# EAGLE design SPinner (EAGLE 9.4.2)
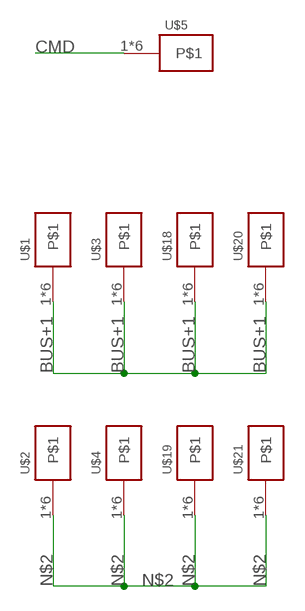
[diagram p0: schematic, sheet 1]

## Parts
U$1  KCONNECT  [KCONNECT]
U$2  KCONNECT  [KCONNECT]
U$3  KCONNECT  [KCONNECT]
U$4  KCONNECT  [KCONNECT]
U$5  KCONNECTQUAD  [KCONNECT_QUAD]
U$18  KCONNECT  [KCONNECT]
U$19  KCONNECT  [KCONNECT]
U$20  KCONNECT  [KCONNECT]
U$21  KCONNECT  [KCONNECT]

## Nets
BUS+1: U$1.1 U$1.2 U$1.3 U$1.4 U$1.P$1 U$1.P$2 U$3.1 U$3.2 U$3.3 U$3.4 U$3.P$1 U$3.P$2 U$18.1 U$18.2 U$18.3 U$18.4 U$18.P$1 U$18.P$2 U$20.1 U$20.2 U$20.3 U$20.4 U$20.P$1 U$20.P$2
CMD: U$5.1 U$5.2 U$5.3 U$5.4 U$5.P$1 U$5.P$2
N$2: U$2.1 U$2.2 U$2.3 U$2.4 U$2.P$1 U$2.P$2 U$4.1 U$4.2 U$4.3 U$4.4 U$4.P$1 U$4.P$2 U$19.1 U$19.2 U$19.3 U$19.4 U$19.P$1 U$19.P$2 U$21.1 U$21.2 U$21.3 U$21.4 U$21.P$1 U$21.P$2

## Library data of the parts
U$1-U$5 U$18-U$21 = CanCubeSat:KCONNECT

## Board
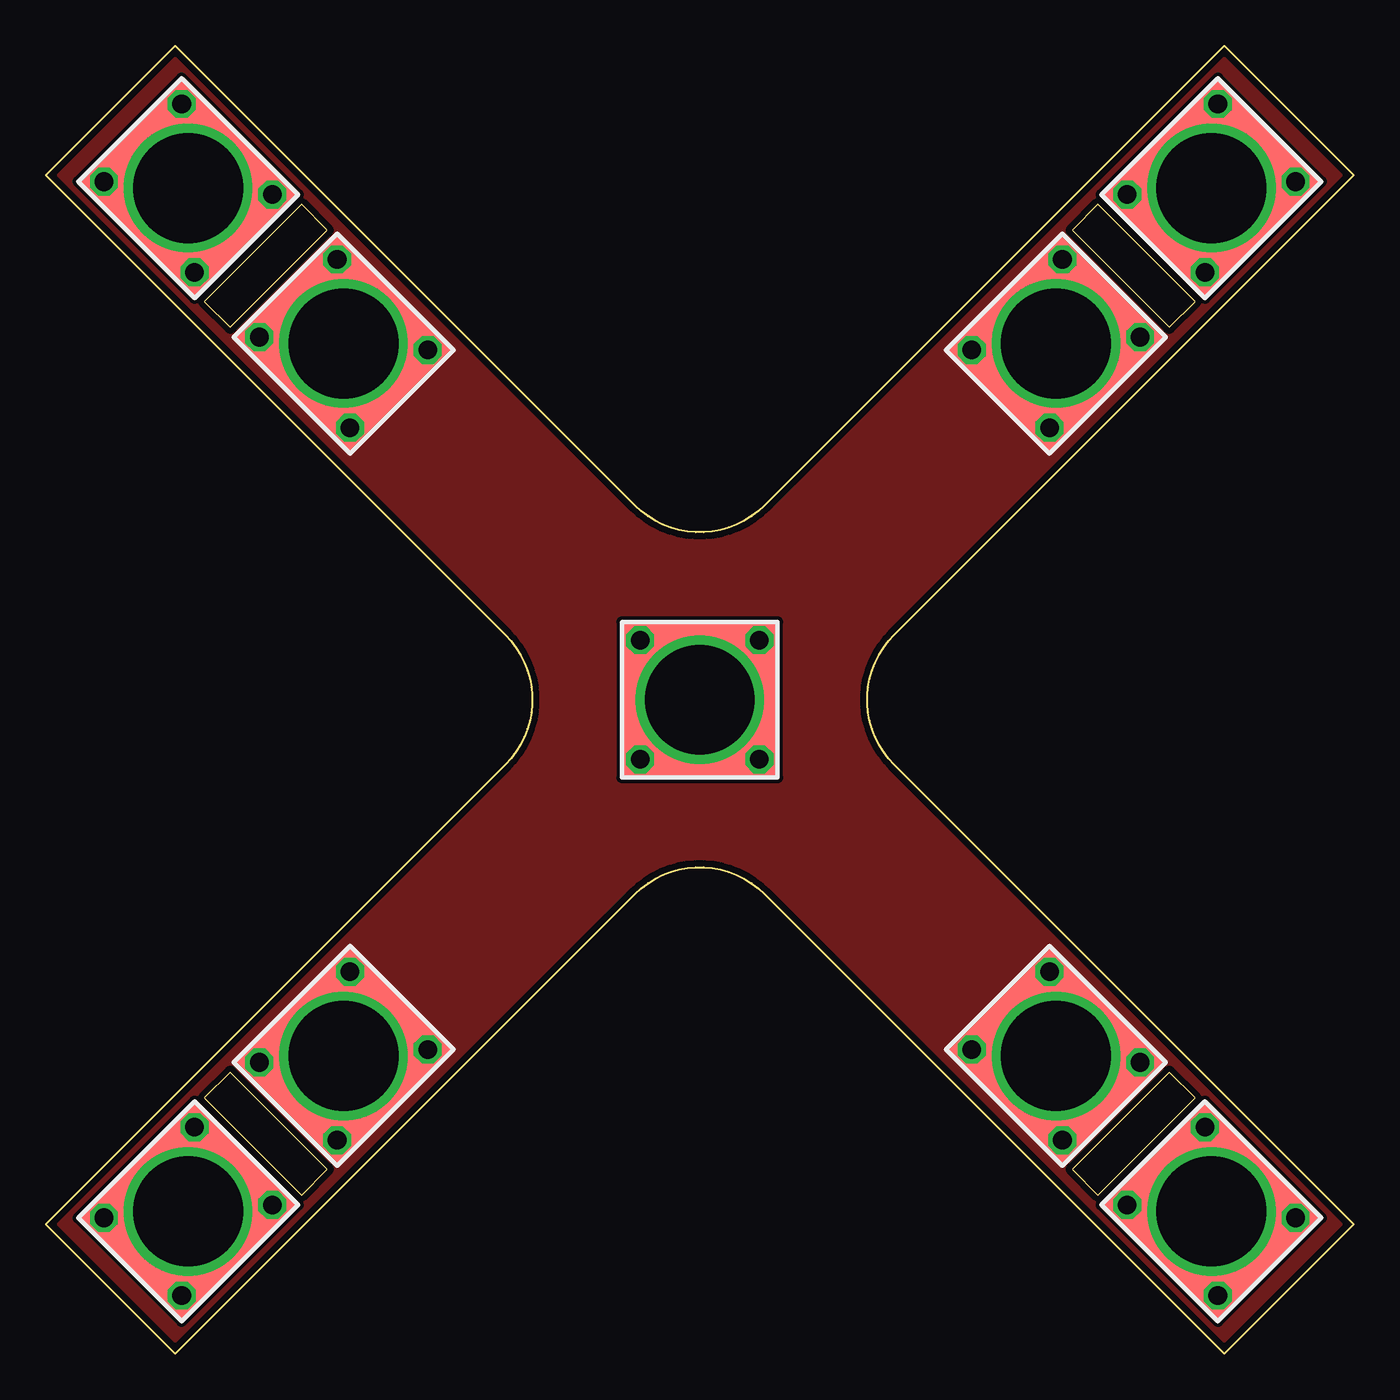
[diagram p1: board, top side]
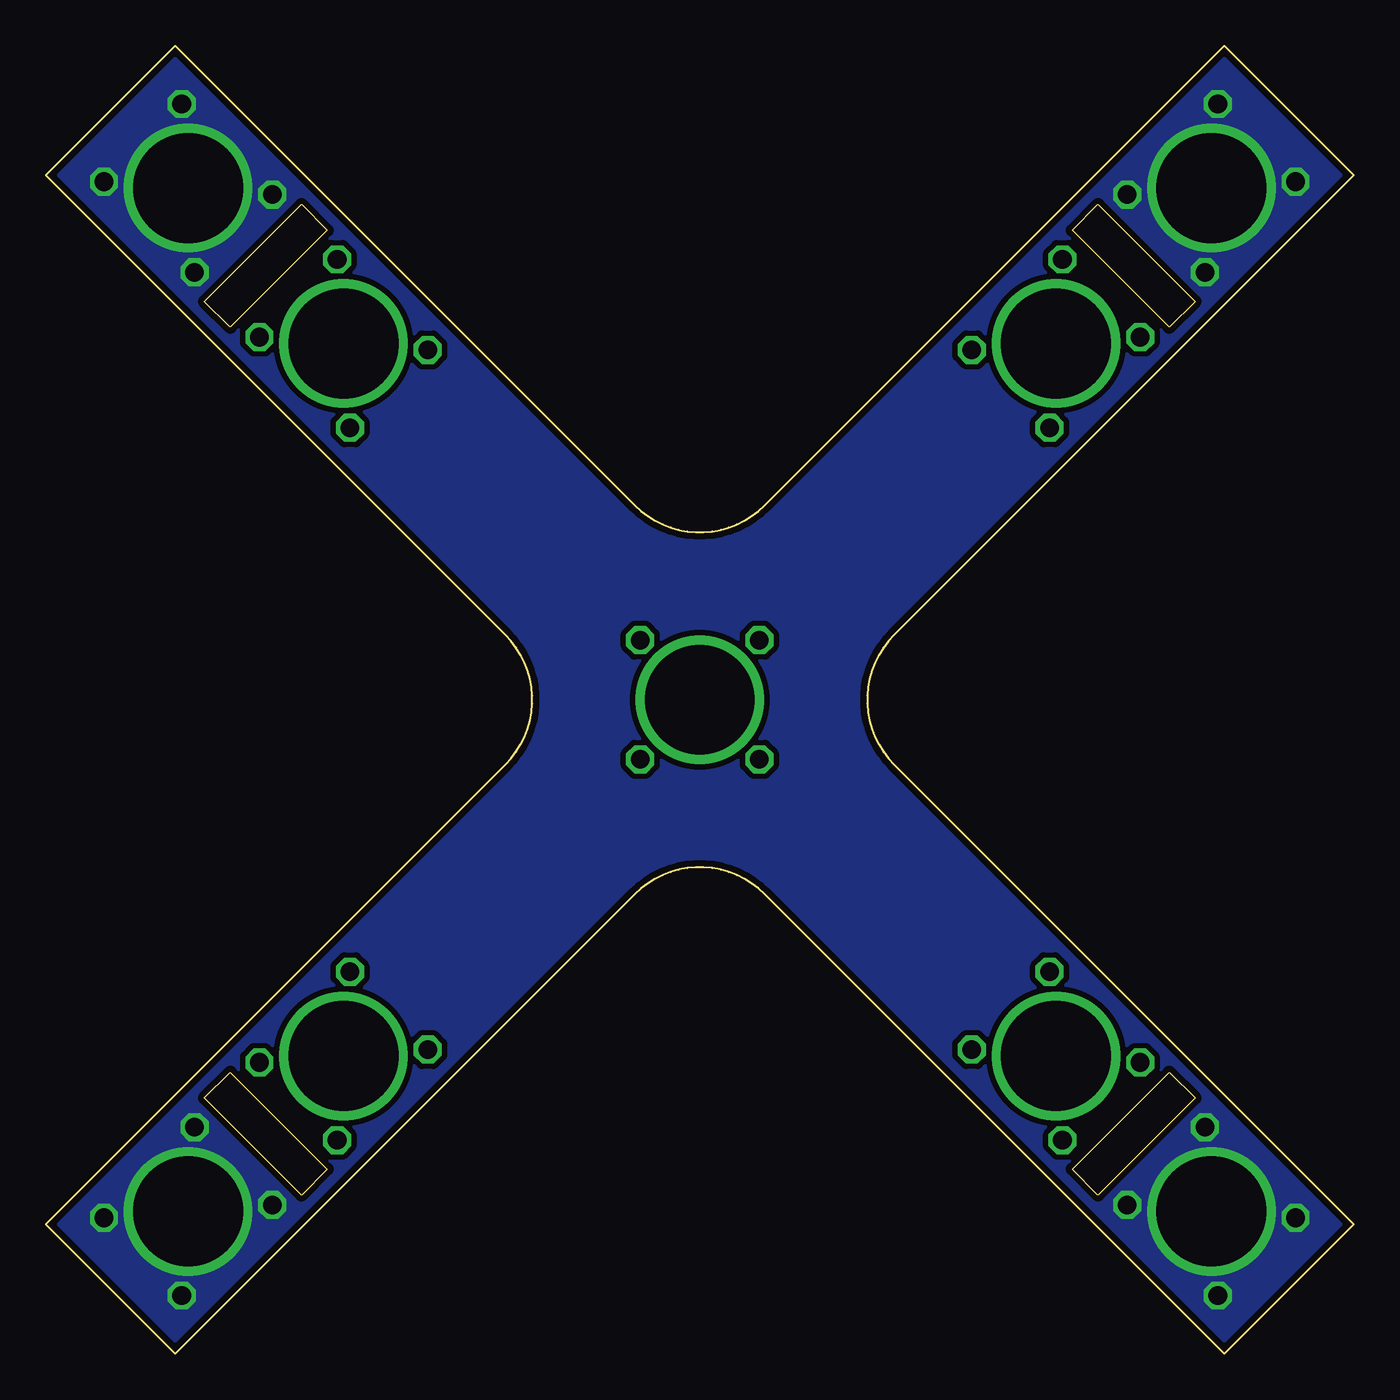
[diagram p2: board, bottom side, seen from below]

Size 71.4 x 71.4 mm. Coordinates in mm from the lower left corner, seen from the top.
Outline: 13.96,62.75 8.65,57.45 10.07,56.03 15.37,61.33 13.96,62.75
Outline: 8.65,13.96 13.96,8.65 15.37,10.07 10.07,15.37 8.65,13.96
Outline: 57.45,62.75 56.03,61.33 61.33,56.03 62.75,57.45 57.45,62.75
Outline: 56.03,10.07 57.45,8.65 62.75,13.96 61.33,15.37 56.03,10.07
Outline: 0,7.07 25.09,32.17 arc90 25.09,39.24 0,64.33 7.07,71.4 32.17,46.31 arc90 39.24,46.31 64.33,71.4 71.4,64.33 46.31,39.24 arc90 46.31,32.17 71.4,7.07 64.33,0 39.24,25.09 arc90 32.17,25.09 7.07,0 0,7.07
Copper layers (1*16): Top 0.035mm / dielectric 1.5mm / Bottom 0.035mm
Design rules "default *": minimum track width 0.8mm, minimum drill 0.35mm, track to track 0.2mm, track to pad 0.2mm, pad to pad 0.2mm, via to via 0.2mm, smd to smd 0.2mm, copper to edge 0.35mm, drill to drill 6mil, minimum pad ring 10mil, minimum via ring 8mil, stop-mask expansion 2mil, vias tented up to drill 0mil, thermal gap 10mil

### Footprints (pad centres in the part's own frame; a part is rotated, then mirrored left to right if it is on the bottom)
KCONNECT = drill 1.016 octagon: 1 -3,-3.5; 2 -3,3.5; 3 3,-3.5; 4 3,3.5 | drill 6: P$1 0,0 | smd 8 x 9: P$2 0,0
KCONNECT_QUAD = drill 1.016 octagon: 1 -3.25,-3.25; 2 -3.25,3.25; 3 3.25,-3.25; 4 3.25,3.25 | drill 6: P$1 0,0 | smd 8.5 x 8.5: P$2 0,0

### Placement (x,y rotation side)
U$1  7.77,63.63 225 top
U$2  16.26,55.15 45 top
U$3  63.63,63.63 135 top
U$4  55.15,55.15 315 top
U$5  35.7,35.7 0 top
U$18  7.77,7.77 315 top
U$19  16.26,16.26 315 top
U$20  63.63,7.77 45 top
U$21  55.15,16.26 225 top

### Tracks (layer width: path | path; a pad name or v marks a point on that pad's centre or on a via)
BUS+1
  pour Bottom (isolate 0.3, no thermals): -0.38,71.8 -0.38,-0.31 71.87,-0.31 71.87,71.8
CMD
  Top 0.8: U$5.P$1 U$5.1 | U$5.P$1 38.7,32.7 U$5.3 | U$5.P$1 32.7,38.7 U$5.2 | U$5.4 U$5.P$1
N$2
  pour Top (isolate 0.3, no thermals): -0.38,71.8 -0.38,-0.31 71.87,-0.31 71.87,71.8